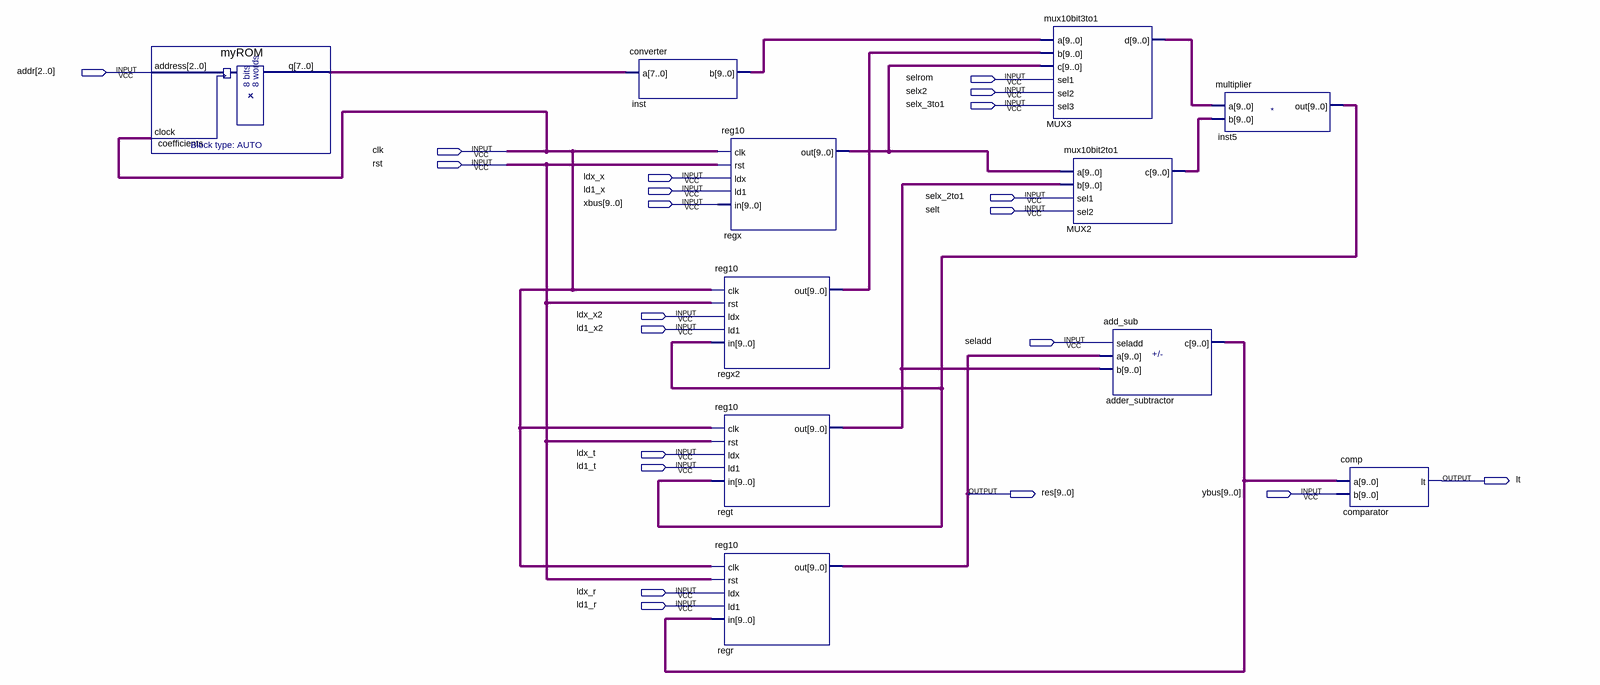
[diagram p0: schematic sheet]
// Quartus schematic datapath.bdf as structural Verilog: 11 symbols, 21 pins
module datapath (
  input  [2:0] addr,
  input  selrom,
  input  selx2,
  input  selx_3to1,
  input  clk,
  input  rst,
  input  ldx_x,
  input  ld1_x,
  input  selx_2to1,
  input  [9:0] xbus,
  input  selt,
  input  ldx_x2,
  input  ld1_x2,
  input  seladd,
  input  ldx_t,
  input  ld1_t,
  input  [9:0] ybus,
  input  ldx_r,
  input  ld1_r,
  output lt,
  output [9:0] res
);

  wire [7:0] coefficients_q;
  wire [9:0] adder_subtractor_c, inst5_out, inst_b, MUX2_c, MUX3_d, regt_out, regx2_out, regx_out;

  myROM coefficients (.address(addr), .clock(clk), .q(coefficients_q));
  converter inst (.a(coefficients_q), .b(inst_b));
  reg10 regx (.clk(clk), .rst(rst), .ldx(ldx_x), .ld1(ld1_x), .in(xbus), .out(regx_out));
  reg10 regx2 (.clk(clk), .rst(rst), .ldx(ldx_x2), .ld1(ld1_x2), .in(inst5_out), .out(regx2_out));
  reg10 regt (.clk(clk), .rst(rst), .ldx(ldx_t), .ld1(ld1_t), .in(inst5_out), .out(regt_out));
  reg10 regr (.clk(clk), .rst(rst), .ldx(ldx_r), .ld1(ld1_r), .in(adder_subtractor_c), .out(res));
  mux10bit3to1 MUX3 (
    .a(inst_b), .b(regx2_out), .c(regx_out), .sel1(selrom), .sel2(selx2), .sel3(selx_3to1), .d(MUX3_d));
  mux10bit2to1 MUX2 (.a(regx_out), .b(regt_out), .sel1(selx_2to1), .sel2(selt), .c(MUX2_c));
  add_sub adder_subtractor (.seladd(seladd), .a(res), .b(regt_out), .c(adder_subtractor_c));
  multiplier inst5 (.a(MUX3_d), .b(MUX2_c), .out(inst5_out));
  comp comparator (.a(adder_subtractor_c), .b(ybus), .lt(lt));
endmodule
